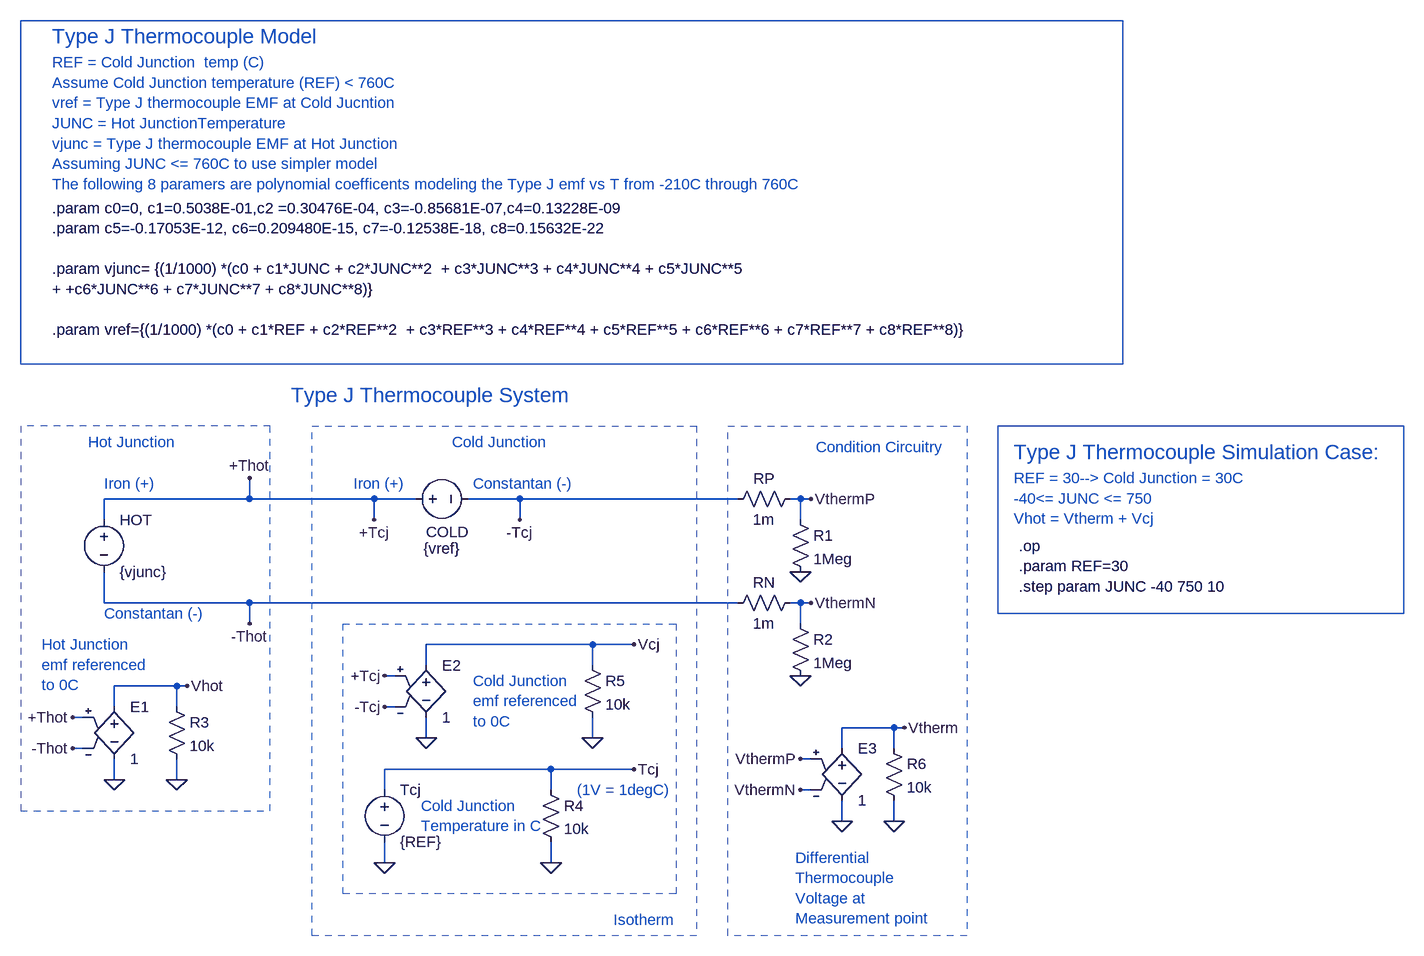
[diagram p0: schematic Type J Therm Model.asc]
Type J Therm Model.asc, the LTspice schematic file:
Version 4
SHEET 1 6036 836
WIRE 432 -32 432 -64
WIRE 432 -32 208 -32
WIRE 624 -32 432 -32
WIRE 688 -32 624 -32
WIRE 848 -32 768 -32
WIRE 1184 -32 848 -32
WIRE 1280 -32 1264 -32
WIRE 1296 -32 1280 -32
WIRE 208 0 208 -32
WIRE 624 0 624 -32
WIRE 848 0 848 -32
WIRE 1280 0 1280 -32
WIRE 208 128 208 80
WIRE 432 128 208 128
WIRE 1184 128 432 128
WIRE 1280 128 1264 128
WIRE 1296 128 1280 128
WIRE 432 160 432 128
WIRE 1280 160 1280 128
WIRE 960 192 704 192
WIRE 1024 192 960 192
WIRE 704 224 704 192
WIRE 960 224 960 192
WIRE 656 240 640 240
WIRE 320 256 224 256
WIRE 336 256 320 256
WIRE 224 288 224 256
WIRE 320 288 320 256
WIRE 656 288 640 288
WIRE 176 304 160 304
WIRE 1424 320 1344 320
WIRE 1440 320 1424 320
WIRE 704 336 704 304
WIRE 960 336 960 304
WIRE 176 352 160 352
WIRE 1344 352 1344 320
WIRE 1424 352 1424 320
WIRE 1296 368 1280 368
WIRE 896 384 640 384
WIRE 1024 384 896 384
WIRE 224 400 224 368
WIRE 320 400 320 368
WIRE 640 416 640 384
WIRE 896 416 896 384
WIRE 1296 416 1280 416
WIRE 1344 464 1344 432
WIRE 1424 464 1424 432
WIRE 640 528 640 496
WIRE 896 528 896 496
FLAG 224 400 0
FLAG 320 400 0
FLAG 160 304 +Thot
FLAG 160 352 -Thot
FLAG 336 256 Vhot
FLAG 624 0 +Tcj
FLAG 848 0 -Tcj
FLAG 704 336 0
FLAG 640 240 +Tcj
FLAG 640 288 -Tcj
FLAG 640 528 0
FLAG 896 528 0
FLAG 960 336 0
FLAG 1024 192 Vcj
FLAG 1024 384 Tcj
FLAG 432 -64 +Thot
FLAG 432 160 -Thot
FLAG 1296 -32 VthermP
FLAG 1296 128 VthermN
FLAG 1280 240 0
FLAG 1280 80 0
FLAG 1344 464 0
FLAG 1424 464 0
FLAG 1440 320 Vtherm
FLAG 1280 368 VthermP
FLAG 1280 416 VthermN
SYMBOL voltage 208 -16 R0
WINDOW 123 0 0 Left 0
WINDOW 39 0 0 Left 0
SYMATTR InstName HOT
SYMATTR Value {vjunc}
SYMBOL voltage 672 -32 R270
WINDOW 123 0 0 Left 0
WINDOW 39 0 0 Left 0
WINDOW 0 -51 32 VRight 2
WINDOW 3 -76 28 VRight 2
SYMATTR InstName COLD
SYMATTR Value {vref}
SYMBOL e 224 272 R0
SYMATTR InstName E1
SYMATTR Value 1
SYMBOL res 304 272 R0
SYMATTR InstName R3
SYMATTR Value 10k
SYMBOL e 704 208 R0
SYMATTR InstName E2
SYMATTR Value 1
SYMBOL voltage 640 400 R0
WINDOW 123 0 0 Left 0
WINDOW 39 0 0 Left 0
SYMATTR InstName Tcj
SYMATTR Value {REF}
SYMBOL res 880 400 R0
SYMATTR InstName R4
SYMATTR Value 10k
SYMBOL res 944 208 R0
SYMATTR InstName R5
SYMATTR Value 10k
SYMBOL res 1280 112 R90
WINDOW 0 0 56 VBottom 2
WINDOW 3 32 56 VTop 2
SYMATTR InstName RN
SYMATTR Value 1m
SYMBOL res 1280 -48 R90
WINDOW 0 0 56 VBottom 2
WINDOW 3 32 56 VTop 2
SYMATTR InstName RP
SYMATTR Value 1m
SYMBOL res 1264 -16 R0
SYMATTR InstName R1
SYMATTR Value 1Meg
SYMBOL res 1264 144 R0
SYMATTR InstName R2
SYMATTR Value 1Meg
SYMBOL e 1344 336 R0
SYMATTR InstName E3
SYMATTR Value 1
SYMBOL res 1408 336 R0
SYMATTR InstName R6
SYMATTR Value 10k
TEXT 128 -480 Left 2 !.param c0=0, c1=0.5038E-01,c2 =0.30476E-04, c3=-0.85681E-07,c4=0.13228E-09\n.param c5=-0.17053E-12, c6=0.209480E-15, c7=-0.12538E-18, c8=0.15632E-22\n \n.param vjunc= {(1/1000) *(c0 + c1*JUNC + c2*JUNC**2  + c3*JUNC**3 + c4*JUNC**4 + c5*JUNC**5 \n+ +c6*JUNC**6 + c7*JUNC**7 + c8*JUNC**8)}\n \n.param vref={(1/1000) *(c0 + c1*REF + c2*REF**2  + c3*REF**3 + c4*REF**4 + c5*REF**5 + c6*REF**6 + c7*REF**7 + c8*REF**8)}
TEXT 496 -192 Left 3 ;Type J Thermocouple System
TEXT 992 616 Left 2 ;Isotherm
TEXT 1616 40 Left 2 !.op\n.param REF=30\n.step param JUNC -40 750 10
TEXT 744 -120 Left 2 ;Cold Junction
TEXT 184 -120 Left 2 ;Hot Junction
TEXT 776 248 Left 2 ;Cold Junction\nemf referenced\nto 0C
TEXT 1304 -112 Left 2 ;Condition Circuitry
TEXT 1608 -64 Left 2 ;REF = 30--> Cold Junction = 30C\n-40<= JUNC <= 750 \nVhot = Vtherm + Vcj
TEXT 208 -56 Left 2 ;Iron (+)
TEXT 208 144 Left 2 ;Constantan (-)
TEXT 592 -56 Left 2 ;Iron (+)
TEXT 776 -56 Left 2 ;Constantan (-)
TEXT 128 -704 Left 2 ;REF = Cold Junction  temp (C) \nAssume Cold Junction temperature (REF) < 760C\nvref = Type J thermocouple EMF at Cold Jucntion\nJUNC = Hot JunctionTemperature\nvjunc = Type J thermocouple EMF at Hot Junction\nAssuming JUNC <= 760C to use simpler model\nThe following 8 paramers are polynomial coefficents modeling the Type J emf vs T from -210C through 760C
TEXT 936 416 Left 2 ;(1V = 1degC)
TEXT 128 -744 Left 3 ;Type J Thermocouple Model
TEXT 1608 -104 Left 3 ;Type J Thermocouple Simulation Case:
TEXT 696 440 Left 2 ;Cold Junction\nTemperature in C
TEXT 112 192 Left 2 ;Hot Junction\nemf referenced\nto 0C
TEXT 1272 520 Left 2 ;Differential\nThermocouple\nVoltage at\nMeasurement point
RECTANGLE Normal 1088 576 576 160 1
RECTANGLE Normal 1120 640 528 -144 4
RECTANGLE Normal 80 448 464 -144 4
RECTANGLE Normal 1536 640 1168 -144 4
RECTANGLE Normal 2208 144 1584 -144
RECTANGLE Normal 1776 -240 80 -768

The netlist it stands for:
* Type J Therm Model.asc
V§HOT +Tcj -Thot {vjunc}
V§COLD +Tcj -Tcj {vref}
E1 Vhot 0 +Tcj -Thot 1
R3 Vhot 0 10k
E2 Vcj 0 +Tcj -Tcj 1
V§Tcj Tcj 0 {REF}
R4 Tcj 0 10k
R5 Vcj 0 10k
RN VthermN -Thot 1m
RP VthermP -Tcj 1m
R1 VthermP 0 1Meg
R2 VthermN 0 1Meg
E3 Vtherm 0 VthermP VthermN 1
R6 Vtherm 0 10k
.param c0=0, c1=0.5038E-01,c2 =0.30476E-04, c3=-0.85681E-07,c4=0.13228E-09
.param c5=-0.17053E-12, c6=0.209480E-15, c7=-0.12538E-18, c8=0.15632E-22
.param vjunc= {(1/1000) *(c0 + c1*JUNC + c2*JUNC**2  + c3*JUNC**3 + c4*JUNC**4 + c5*JUNC**5
+ +c6*JUNC**6 + c7*JUNC**7 + c8*JUNC**8)}
.param vref={(1/1000) *(c0 + c1*REF + c2*REF**2  + c3*REF**3 + c4*REF**4 + c5*REF**5 + c6*REF**6 + c7*REF**7 + c8*REF**8)}
* Type J Thermocouple System
* Isotherm
.op
.param REF=30
.step param JUNC -40 750 10
* Cold Junction
* Hot Junction
* Cold Junction
* emf referenced
* to 0C
* Condition Circuitry
* REF = 30--> Cold Junction = 30C
* -40<= JUNC <= 750
* Vhot = Vtherm + Vcj
* Iron (+)
* Constantan (-)
* Iron (+)
* Constantan (-)
* REF = Cold Junction  temp (C)
* Assume Cold Junction temperature (REF) < 760C
* vref = Type J thermocouple EMF at Cold Jucntion
* JUNC = Hot JunctionTemperature
* vjunc = Type J thermocouple EMF at Hot Junction
* Assuming JUNC <= 760C to use simpler model
* The following 8 paramers are polynomial coefficents modeling the Type J emf vs T from -210C through 760C
* (1V = 1degC)
* Type J Thermocouple Model
* Type J Thermocouple Simulation Case:
* Cold Junction
* Temperature in C
* Hot Junction
* emf referenced
* to 0C
* Differential
* Thermocouple
* Voltage at
* Measurement point
.backanno
.end